# Altium schematic sheet Main.SchDoc: Main
size Tabloid; Author: Parker Brown
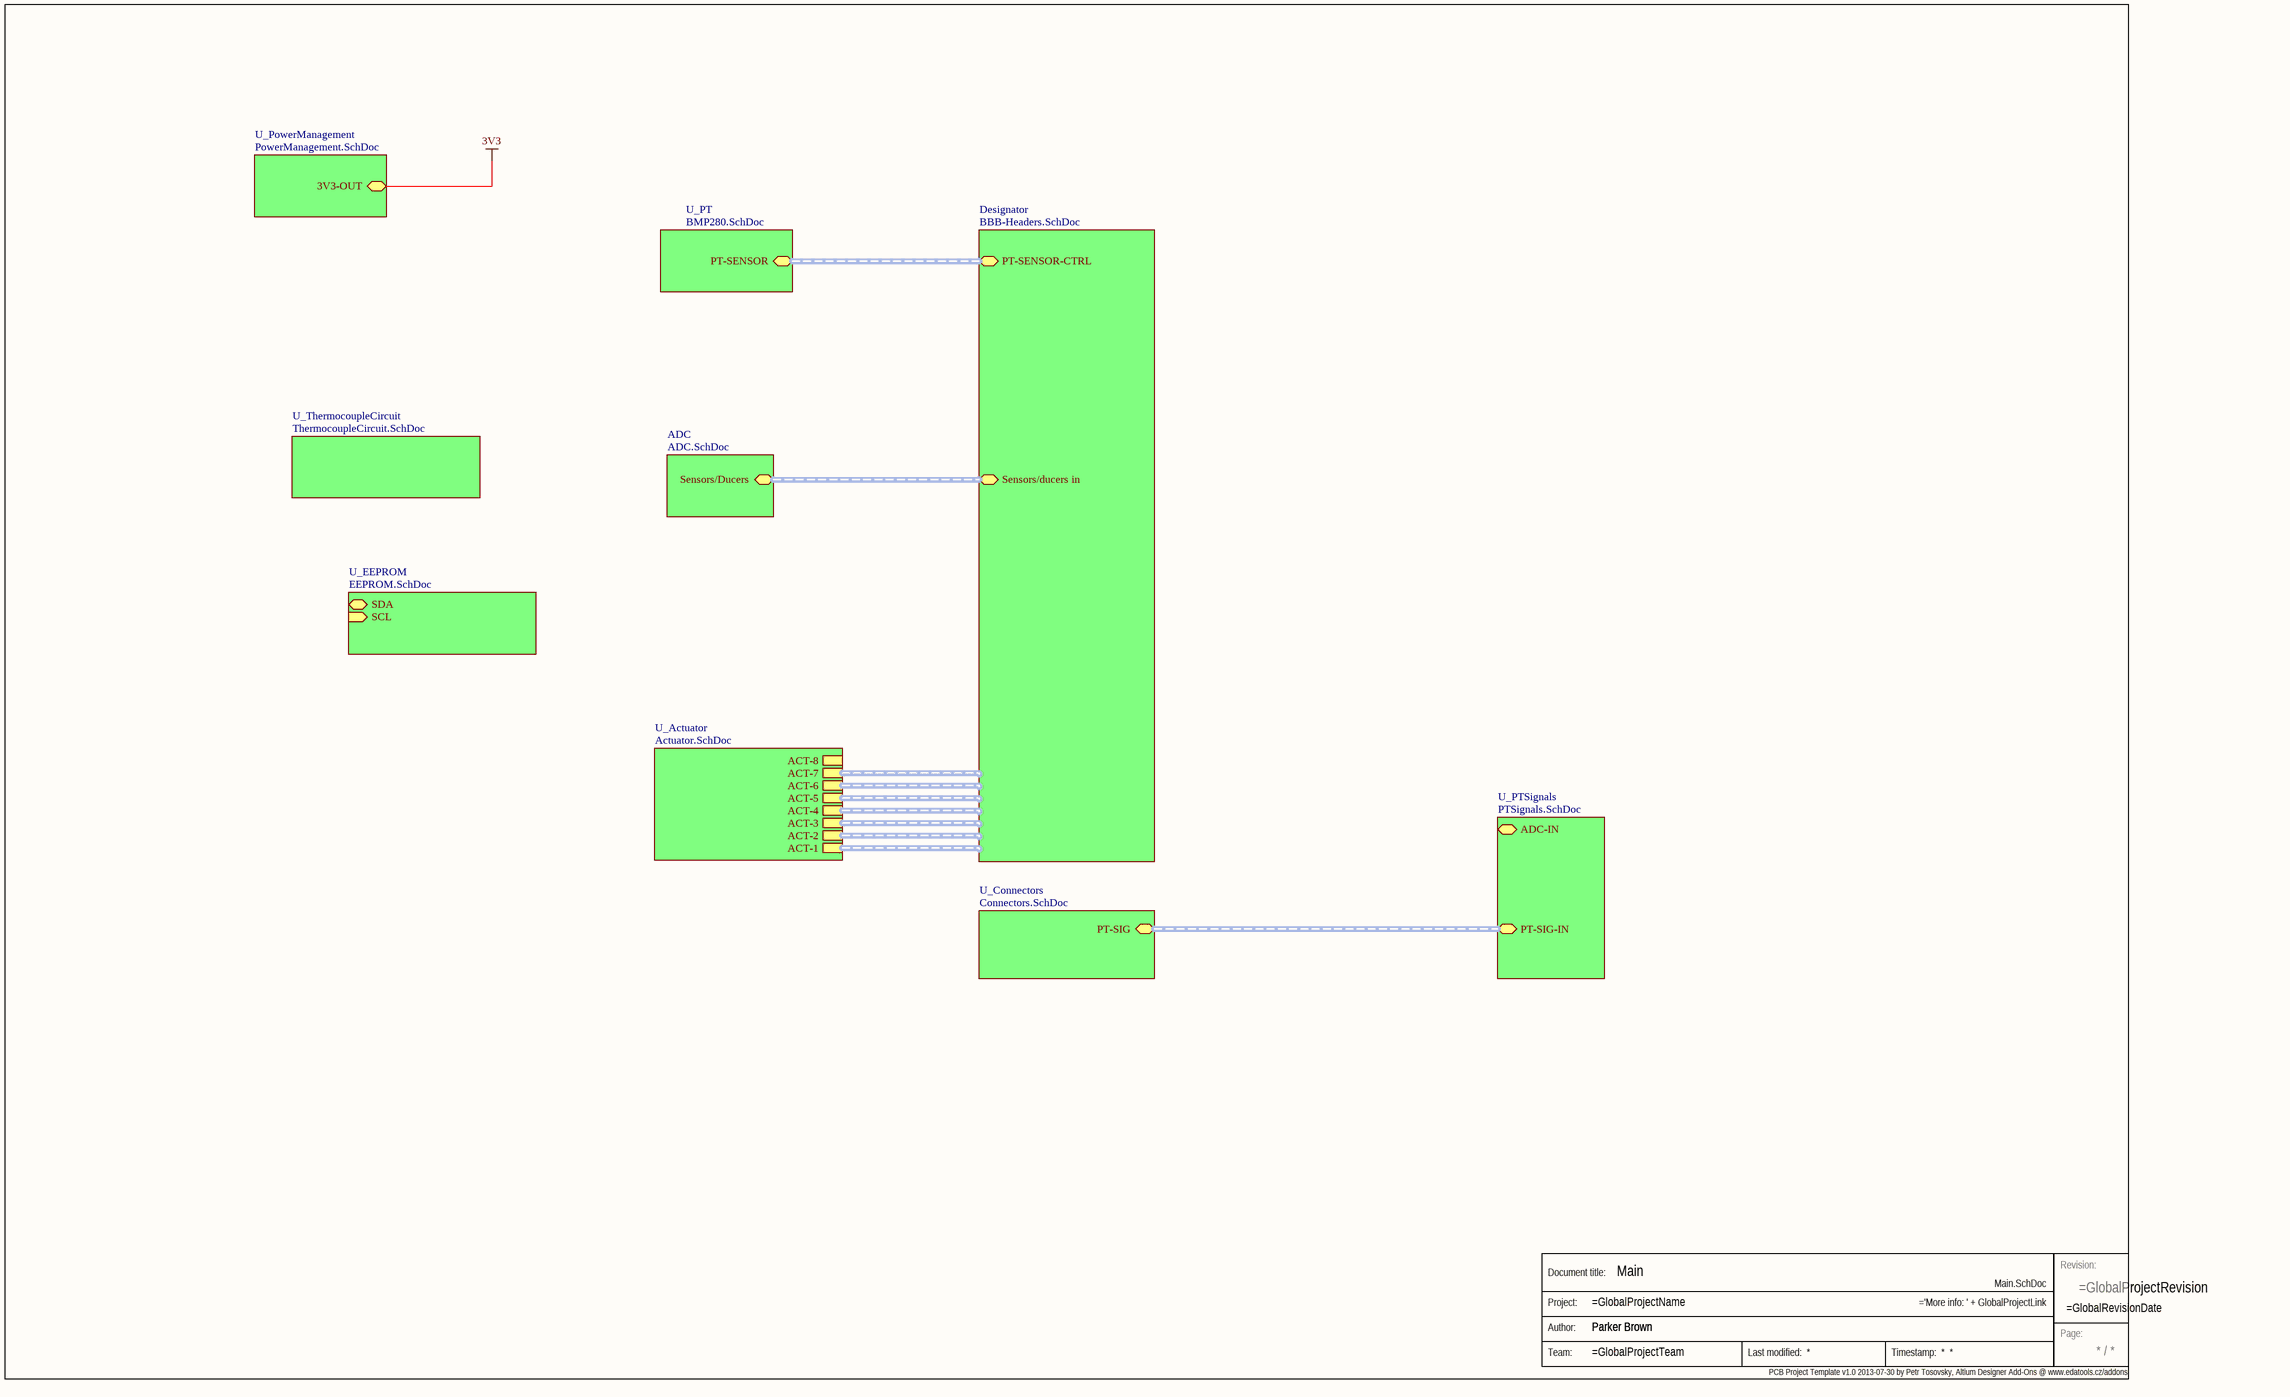
[diagram p0: Main.SchDoc]

## Parts
Stamp  Stamp  (value not drawn)  (graphical)

## Sub-sheets
ADC = ADC.SchDoc: Sensors/Ducers (harness ADC to micro)
Designator = BBB-Headers.SchDoc: PT-SENSOR-CTRL (harness PT-SENSOR), Sensors/ducers in (harness ADC)
U_Actuator = Actuator.SchDoc: ACT-8 (harness ACT), ACT-7 (harness ACT), ACT-6 (harness ACT), ACT-5 (harness ACT), ACT-4 (harness ACT), ACT-3 (harness ACT), ACT-2 (harness ACT), ACT-1 (harness ACT)
U_Connectors = Connectors.SchDoc: PT-SIG (harness PT-SIGNALS)
U_EEPROM = EEPROM.SchDoc: SDA (bidir), SCL (in)
U_PowerManagement = PowerManagement.SchDoc: 3V3-OUT
U_PT = BMP280.SchDoc: PT-SENSOR (harness PT-SENSOR)
U_PTSignals = PTSignals.SchDoc: PT-SIG-IN (harness PT-SIGNALS), ADC-IN (harness ADC)
U_ThermocoupleCircuit = ThermocoupleCircuit.SchDoc: no entries

## Buses and harness runs
harness sheet ADC/Sensors/Ducers = sheet Designator/Sensors/ducers in
harness sheet Designator/PT-SENSOR-CTRL = sheet U_PT/PT-SENSOR
harness sheet U_Connectors/PT-SIG = sheet U_PTSignals/PT-SIG-IN

## Notes on the sheet
- PCB Project Template v1.0 2013-07-30 by Petr Tosovsky, Altium Designer Add-Ons @ www.edatools.cz/addons <http://www.edatools.cz/addons>
- Labels drawn without touching a wire or pin: 3V3
- (in symbol Stamp) Revision:; Document title:; Project:; Author:; Page:; Team: